# Altium schematic sheet 4G.SchDoc
size B
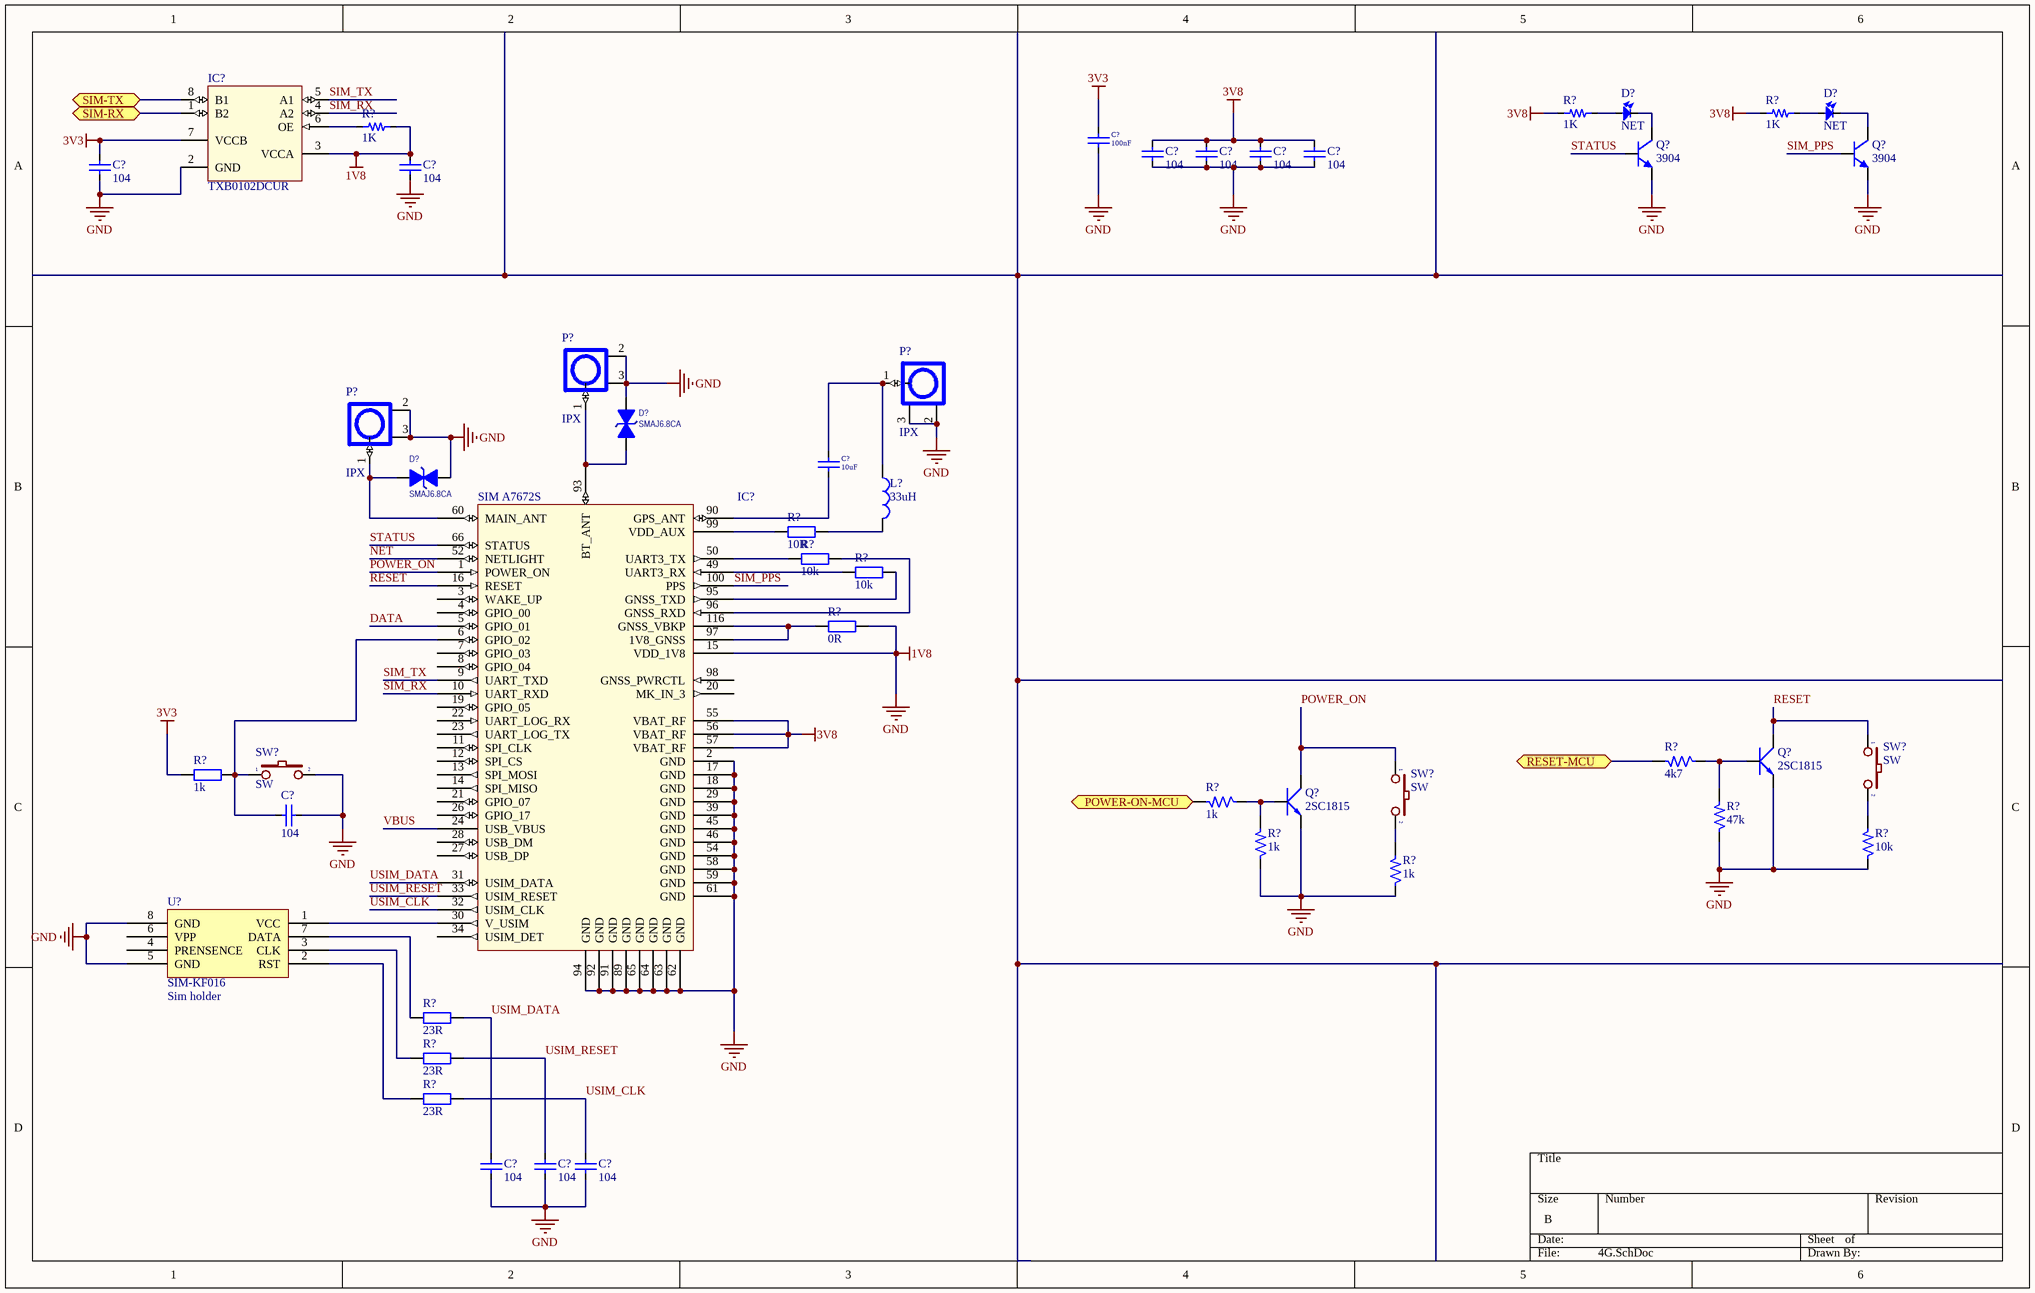
[diagram p0: 4G.SchDoc]

## Parts
(Parts that share a designator on the sheet are numbered #1, #2 ... from top to bottom, then left to right.)
C?#1  100nF  [CAP_0402]
C?#2  104  [CAP_0402]
C?#3  104  [CAP_0402]
C?#4  104  [CAP_0402]
C?#5  104  [CAP_0402]
C?#6  104  [CAP_0402]
C?#7  104  [CAP_0402]
C?#8  10uF  [CAP_0402]
C?#9  104  [CAP_0402]
C?#10  104  [CAP_0402]
C?#11  104  [CAP_0402]
C?#12  104  [CAP_0402]
D?#1  NET  [LED-3]
D?#2  NET  [LED-3]
D?#3  SMAJ6.8CA  [SOD323 - DO241]
D?#4  SMAJ6.8CA  [SOD323 - DO241]
IC?#1  TXB0102DCUR  [SOP50P310X90-8N]
IC?#2  SIM A7672S  [A7672S]
L?  33uH  [Inductor_SMD]
P?#1  IPX  [IPXS]
P?#2  IPX  [IPXS]
P?#3  IPX  [IPXS]
Q?#1  3904  [TRAN-LOWPOWER]
Q?#2  3904  [TRAN-LOWPOWER]
Q?#3  2SC1815  [TO92-123]
Q?#4  2SC1815  [TO92-123]
R?#1  1K  [RES-SMD-0101]
R?#2  1K  [RES-SMD-0101]
R?#3  1K  [RES-SMD-0101]
R?#4  10R  [RES-SMD-0805]
R?#5  10k  [RES-SMD-0805]
R?#6  10k  [RES-SMD-0805]
R?#7  0R  [RES-SMD-0805]
R?#8  4k7  [SM-1206]
R?#9  1k  [RES-SMD-0805]
R?#10  1k  [SM-1206]
R?#11  47k  [SM-1206]
R?#12  1k  [SM-1206]
R?#13  10k  [SM-1206]
R?#14  1k  [SM-1206]
R?#15  23R  [RES-SMD-0805]
R?#16  23R  [RES-SMD-0805]
R?#17  23R  [RES-SMD-0805]
SW?#1  SW  [SW2]
SW?#2  SW  [SW2]
SW?#3  SW  [SW2]
U?  SIM-KF016  value Sim holder  [Sim Socket]

## Ports
POWER-ON-MCU (bidir), RESET-MCU (bidir), SIM-RX (bidir), SIM-TX (bidir)

## Nets
1V8: C?#1.1 C?#2.1 C?#3.1 C?#4.1 C?#5.1 C?#6.1 C?#7.1 C?#7.2 C?#9.1 C?#10.2 C?#11.2 C?#12.2 D?#3.2(K) D?#4.1(A) IC?#1.2(GND) IC?#1.3(VCCA) IC?#2.2(GND) IC?#2.15(RESERVED) IC?#2.17(GND) IC?#2.18(GND) IC?#2.29(KEYPAD_0) IC?#2.39(GND) IC?#2.45(GND) IC?#2.46(ADC2) IC?#2.54(GPIO4) IC?#2.58(GND) IC?#2.59(GND) IC?#2.61(GND) IC?#2.62(GND) IC?#2.63(GND) IC?#2.64(GND) IC?#2.65(GND) IC?#2.89(GND) IC?#2.91(GND) IC?#2.92(GND) IC?#2.94(GND) P?#1.2 P?#1.3 P?#2.2 P?#2.3 P?#3.2 P?#3.3 Q?#1.2(E) Q?#2.2(E) Q?#3.1(E) Q?#4.1(E) R?#3.2 R?#7.1 R?#11.1 R?#12.1 R?#13.1 R?#14.1 SW?#2.2 U?.5(GND) U?.8(GND)  [also labelled GND]
3V3: C?#1.2 C?#6.2 IC?#1.7(VCCB) R?#9.2
3V8: C?#2.2 C?#3.2 C?#4.2 C?#5.2 IC?#2.55(VBAT_RF) IC?#2.56(VBAT_RF) IC?#2.57(VBAT_RF) R?#1.1 R?#2.1
DATA: IC?#2.5(GPIO_01)
NET: IC?#2.52(GPIO41)
POWER-ON-MCU: R?#10.2 ; port POWER-ON-MCU
POWER_ON: IC?#2.1(POWER_ON) Q?#4.2(C) SW?#3.1
RESET: IC?#2.16(RESERVED) Q?#3.2(C) SW?#1.1
RESET-MCU: R?#8.2 ; port RESET-MCU
SIM-RX: IC?#1.1(B2) ; port SIM-RX
SIM-TX: IC?#1.8(B1) ; port SIM-TX
SIM_PPS: IC?#2.100(PPS) Q?#2.1(B)
SIM_RX: IC?#1.4(A2) IC?#2.10(UART_RXD)
SIM_TX: IC?#1.5(A1) IC?#2.9(UART_TXD)
STATUS: IC?#2.66(STATUS) Q?#1.1(B)
USIM_CLK: C?#12.1 IC?#2.32(KEYSENSE_N3) R?#17.1
USIM_DATA: C?#10.1 IC?#2.31(KEYSENSE_N2) R?#15.1
USIM_RESET: C?#11.1 IC?#2.33(KEYPAD_1) R?#16.1
VBUS: IC?#2.24(MIC1N)
NetC?#8_1: C?#8.1 IC?#2.90(GPS_ANT)
NetC?#8_2: C?#8.2 L?.1 P?#2.1
NetC?#9_2: C?#9.2 IC?#2.6(GPIO_02) R?#9.1 SW?#2.1
NetD?#1_1: D?#1.1 R?#1.2
NetD?#1_2: D?#1.2 Q?#1.3(C)
NetD?#2_1: D?#2.1 R?#2.2
NetD?#2_2: D?#2.2 Q?#2.3(C)
NetD?#3_1: D?#3.1(A) IC?#2.93(BT_ANT) P?#1.1
NetD?#4_2: D?#4.2(K) IC?#2.60(MAIN_ANT) P?#3.1
NetIC?#1_6: IC?#1.6(OE) R?#3.1
NetIC?#2_30: IC?#2.30(KEYPAD_2) U?.1(VCC)
NetIC?#2_49: IC?#2.49(GPIO40) R?#6.2
NetIC?#2_50: IC?#2.50(GPIO43) R?#5.2
NetIC?#2_95: IC?#2.95(GNSS_TXD) R?#6.1
NetIC?#2_96: IC?#2.96(GNSS_RXD) R?#5.1
NetIC?#2_97: IC?#2.97(1V8_GNSS) IC?#2.116(GNSS_VBKP) R?#7.2
NetIC?#2_99: IC?#2.99(VDD_AUX) R?#4.2
NetL?_2: L?.2 R?#4.1
NetQ?#3_3: Q?#3.3(B) R?#8.1 R?#11.2
NetQ?#4_3: Q?#4.3(B) R?#10.1 R?#12.2
NetR?#13_2: R?#13.2 SW?#1.2
NetR?#14_2: R?#14.2 SW?#3.2
NetR?#15_2: R?#15.2 U?.7(DATA)
NetR?#16_2: R?#16.2 U?.3(CLK)
NetR?#17_2: R?#17.2 U?.2(RST)

Not connected (* = marked no-connect by the designer): IC?#2 3(WAKE_UP) 4(GPIO_00) 7(GPIO_03) 8(GPIO_04) 11(SPI_CLK) 12(SPI_CS) 13(SPI_MOSI) 14(SPI_MISO) 19(GPIO_05) 20(MK_IN_3) 21(SPK_M) 22(SPK_P) 23(MIC1P) 25(EAR1N) 26(EAR1P) 27(KEYSENSE_N1) 28(KEYSENSE_N0) 34(KEYPAD_4) 35(KEYPAD_3) 36(KEYSENSE_N4) 47(ADC1) 48(GPIO44) 51(GPIO1) 53(GPIO42) 73(PCM_DOUT) 74(PCM_DIN) 75(PCM_SYNC) 76(PCM_CLK) 98(GNSS_PWRCTL); U? 4(PRENSENCE) 6(VPP)

## Library data of the parts
C?#1 = CapSMD_5: Capacitor; Value: 33p; Published: 8-Jun-2000; LatestRevisionDate: 17-Jul-2002; LatestRevisionNote: Re-released for DXP Platform.; PackageReference: RAD-0.3; Publisher: Altium Limited
C?#2-C?#7 = CapSMD_9: Capacitor; Value: 33p; Published: 8-Jun-2000; LatestRevisionDate: 17-Jul-2002; LatestRevisionNote: Re-released for DXP Platform.; PackageReference: RAD-0.3; Publisher: Altium Limited
C?#8 = CapSMD_1: Capacitor; Value: 33p; Published: 8-Jun-2000; LatestRevisionDate: 17-Jul-2002; LatestRevisionNote: Re-released for DXP Platform.; PackageReference: RAD-0.3; Publisher: Altium Limited
C?#9-C?#12 = CapSMD: Capacitor; Value: 33p; Published: 8-Jun-2000; LatestRevisionDate: 17-Jul-2002; LatestRevisionNote: Re-released for DXP Platform.; PackageReference: RAD-0.3; Publisher: Altium Limited
D?#1 D?#2 = LED_2: LED Single colour Green and Red; Value: LED 3 ly Single Colour
D?#3 D?#4 = SMAJ30CA-30V/8.3A: TVS DIODE 30VWM 48.4VC SMA; Manufacturer: Bourns Inc.; Part number: PSD12C; Category: Circuit Protection; Package: SOD323; User_Description: TVS DIODE 30VWM 48.4VC SMA
IC?#1 = TXB0102DCUR: IC TRNSLTR BIDIRECTIONAL US8; Manufacturer: Texas Instruments; Category: IC Logic Level; Package: 8-VSSOP; Part number: TXB0102DCUR; User_Description: IC TRNSLTR BIDIRECTIONAL US8
IC?#2 = SIM A7672S: SIM A7672S-CAT-M1; Part number: SIM A7672S
L? = L1: 22µH Shielded Inductor 1.65A 96mOhm Max Nonstandard; Manufacturer: Bourns Inc.; Part Number: SRR0745A-220M; Value: 220uH; User_Description: FIXED IND 22UH 1.65A 96 MOHM SMD; Category: INDUCTORS; Package: SMD
P?#1-P?#3 = IPXSx66: Antenna GSM GPS; Manufacturer: TE Connectivity AMP Connectors; Part number: 2334884-1; User_Description: UMCC MICRO-COAX RECEPTACLE, GEN; Category: Connectors; Package: SMD
Q?#1 Q?#2 = MMBT3904
Q?#3 Q?#4 = 2SC1815: NPN 600mW, ECB; Value: C1815
R?#1-R?#3 = Resistor - SMD: Resistor; Manufacturer: Generic Components; Class: Passive; Published: 08/06/2000; Publisher: Altium Hobart Technology Centre
R?#4-R?#7 R?#9 R?#15-R?#17 = Resistor - SMD: Resistor SMD; Manufacturer: Generic Components; Class: Passive; Published: 08/06/2000; Publisher: Altium Hobart Technology Centre
R?#8 R?#10-R?#14 = R: Resistor 1/4W; Value: R1/4W - 1K
SW?#1-SW?#3 = SW2: Switch button 2 pin; Value: SW chip 2 pin
U? = Sim holder: SIM Card Holder KF-016